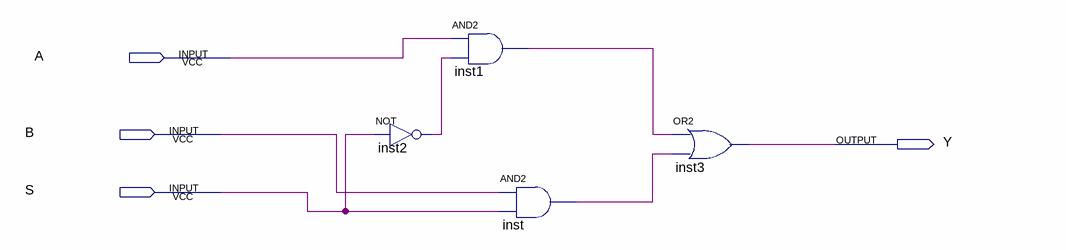
[diagram p0: schematic sheet]
// Quartus schematic singlebitmultiplexer.bdf as structural Verilog: 4 symbols, 4 pins
module singlebitmultiplexer (
  input  A,
  input  B,
  input  S,
  output Y
);

  wire inst1_out, inst2_out, inst_out;

  not inst2 (inst2_out, S);
  and inst1 (inst1_out, A, inst2_out);
  and inst (inst_out, B, S);
  or inst3 (Y, inst1_out, inst_out);
endmodule
